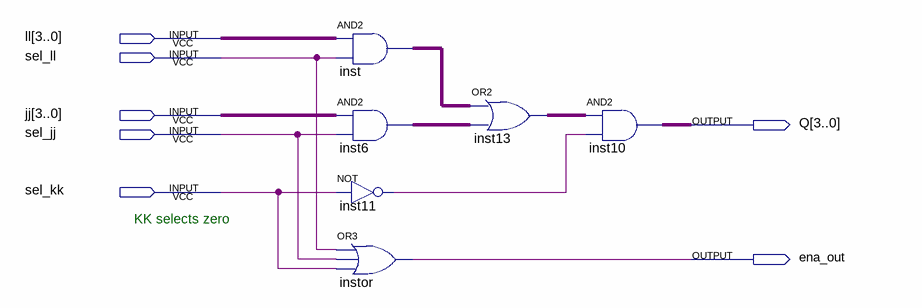
[diagram p0: schematic sheet]
// Quartus schematic alu_op1_mux_low.bdf as structural Verilog: 6 symbols, 7 pins
module alu_op1_mux_low (
  input  [3:0] ll,
  input  sel_ll,
  input  [3:0] jj,
  input  sel_jj,
  input  sel_kk,
  output [3:0] Q,
  output ena_out
);

  wire inst11_out;
  wire [3:0] inst6_out, inst13_out, inst_out;

  assign inst_out = ll & {4{sel_ll}};  // AND2 inst, 4 bits wide
  assign inst6_out = jj & {4{sel_jj}};  // AND2 inst6, 4 bits wide
  not inst11 (inst11_out, sel_kk);
  or instor (ena_out, sel_ll, sel_jj, sel_kk);
  assign inst13_out = inst_out | inst6_out;  // OR2 inst13, 4 bits wide
  assign Q = inst13_out & {4{inst11_out}};  // AND2 inst10, 4 bits wide

  // Notes on the sheet:
  //   KK selects zero
endmodule
